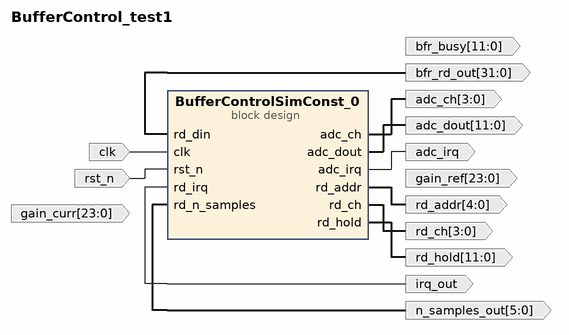
[diagram p0: block diagram of the top level]
# Vivado block design BufferControl_test1, xczu3eg-sbva484-1-i, Vivado 2020.2
create_bd_design BufferControl_test1

create_bd_port -dir I -type clk clk
create_bd_port -dir I -type rst rst_n
create_bd_port -dir O -from 11 -to 0 adc_dout
create_bd_port -dir O -from 23 -to 0 gain_ref
create_bd_port -dir O -from 11 -to 0 bfr_busy
create_bd_port -dir O -from 3 -to 0 adc_ch
create_bd_port -dir O -from 11 -to 0 rd_hold
create_bd_port -dir O -from 4 -to 0 rd_addr
create_bd_port -dir O -from 3 -to 0 rd_ch
create_bd_port -dir O -from 5 -to 0 n_samples_out
create_bd_port -dir O -type intr adc_irq
create_bd_port -dir O -from 31 -to 0 bfr_rd_out
create_bd_port -dir I -from 23 -to 0 gain_curr
create_bd_port -dir O -type intr irq_out

create_bd_cell -type container -reference BufferControlSimConst BufferControlSimConst_0
set_property -dict [list \
  CONFIG.ACTIVE_SIM_BD BufferControlSimConst.bd \
  CONFIG.ACTIVE_SYNTH_BD BufferControlSimConst.bd \
  CONFIG.ENABLE_DFX 0 \
  CONFIG.LIST_SIM_BD BufferControlSimConst.bd \
  CONFIG.LIST_SYNTH_BD BufferControlSimConst.bd \
  CONFIG.LOCK_PROPAGATE 0 \
  CONFIG.TRAINING_MODULE BufferControlSimConst.bd \
] [get_bd_cells BufferControlSimConst_0]

# ---- connections ----

connect_bd_net -net clk_0_1 [get_bd_ports clk] [get_bd_pins BufferControlSimConst_0/clk]
connect_bd_net -net rst_n_0_1 [get_bd_ports rst_n] [get_bd_pins BufferControlSimConst_0/rst_n]
connect_bd_net -net BufferFlowControl_0_irq_out [get_bd_ports irq_out] [get_bd_pins BufferControlSimConst_0/rd_irq]
connect_bd_net -net BufferControlSimulat_0_adc_dout [get_bd_pins BufferControlSimConst_0/adc_dout] [get_bd_ports adc_dout]
connect_bd_net -net BufferControlSimulat_0_adc_ch [get_bd_pins BufferControlSimConst_0/adc_ch] [get_bd_ports adc_ch]
connect_bd_net -net BufferFlowControl_0_n_samples_out [get_bd_ports n_samples_out] [get_bd_pins BufferControlSimConst_0/rd_n_samples]
connect_bd_net -net BufferControlSimulat_0_adc_irq [get_bd_pins BufferControlSimConst_0/adc_irq] [get_bd_ports adc_irq]
connect_bd_net -net BufferFlowControl_0_bfr_rd_out [get_bd_ports bfr_rd_out] [get_bd_pins BufferControlSimConst_0/rd_din]
connect_bd_net [get_bd_pins BufferControlSimConst_0/rd_addr] [get_bd_ports rd_addr]
connect_bd_net [get_bd_pins BufferControlSimConst_0/rd_ch] [get_bd_ports rd_ch]
connect_bd_net [get_bd_pins BufferControlSimConst_0/rd_hold] [get_bd_ports rd_hold]

validate_bd_design
save_bd_design
